# EAGLE design ServoFaderTB6612.V.1.0 (EAGLE 9.6.2)
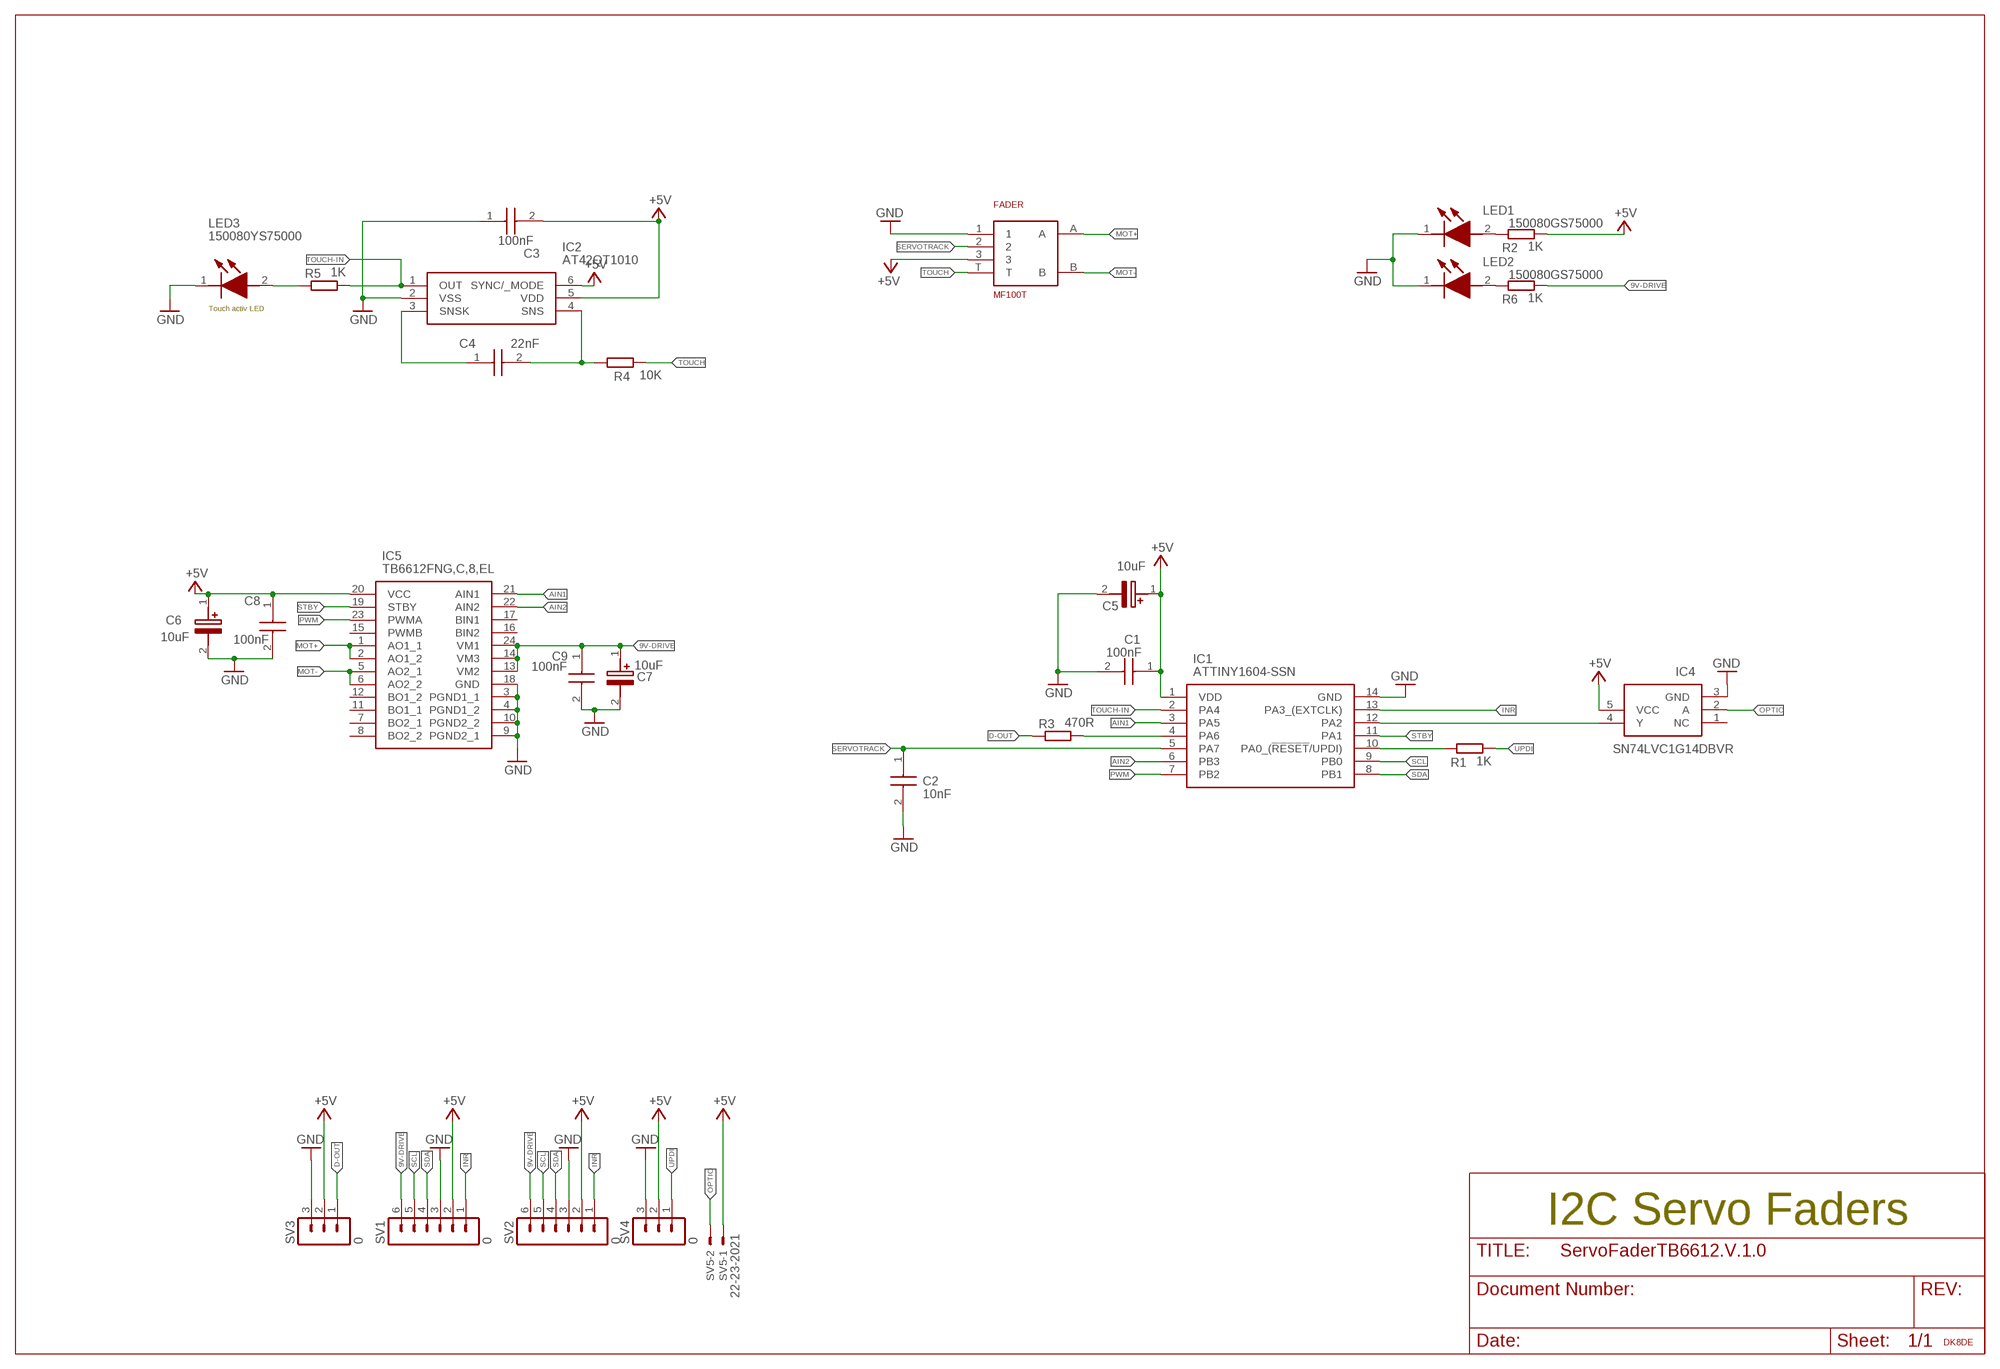
[diagram p0: schematic, sheet 1]

## Parts
C1  100nF  C0805C104K1RACTU  [C0805]
C2  10nF  C0805Y103K4RACTU  [C0805]
C3  100nF  C0805C223K5RAC7210  [C0805]
C4  22nF  C0805C223K5RAC7210  [C0805]
C5  10uF  T491A106M016AT7280  [T491A]
C6  10uF  T491A106M016AT7280  [T491A]
C7  10uF  T491A106M016AT7280  [T491A]
C8  100nF  C0805C104K1RACTU  [C0805]
C9  100nF  C0805C104K1RACTU  [C0805]
FADER  MF100T  SM10001NKA0X-HA1  [SM10001NKA0X-HA1]
IC1  ATTINY1604-SSN  [SOIC127P600X175-14N]
IC2  AT42QT1010  AT42QT1010-TSHR  [SOT95P280X145-6N]
IC4  SN74LVC1G14DBVR  [SOT95P280X145-5N]
IC5  TB6612FNG,C,8,EL  [SOP65P760X160-24N]
LED1  150080GS75000  [LEDM2012X80N]
LED2  150080GS75000  [LEDM2012X80N]
LED3  150080YS75000  [LEDC2012X80N]
LOGO  DK8DESS  [DK8DE_KLEIN]
R1  1K  R-EU_R0805  [R0805]
R2  1K  R-EU_R0805  [R0805]
R3  470R  R-EU_R0805  [R0805]
R4  10K  R-EU_R0805  [R0805]
R5  1K  R-EU_R0805  [R0805]
R6  1K  R-EU_R0805  [R0805]
SV1  0  MA06-1  [MA06-1]
SV2  0  MA06-1  [MA06-1]
SV3  0  MA03-1  [MA03-1]
SV4  0  MA03-1  [MA03-1]
SV5  22-23-2021  [22-23-2021]

## Nets
9V-DRIVE: C7.1(+) C9.1 IC5.13(VM2) IC5.14(VM3) IC5.24(VM1) R6.2 SV1.6 SV2.6
+5V: C1.1 C3.2 C5.1(+) C6.1(+) C8.1 FADER.3 IC1.1(VDD) IC2.5(VDD) IC2.6(SYNC/_MODE) IC4.5(VCC) IC5.20(VCC) R2.2 SV1.2 SV2.2 SV3.2 SV4.2 SV5.1
AIN1: IC1.3(PA5) IC5.21(AIN1)
AIN2: IC1.6(PB3) IC5.22(AIN2)
D-OUT: R3.1 SV3.1
GND: C1.2 C2.2 C3.1 C5.2(-) C6.2(-) C7.2(-) C8.2 C9.2 FADER.1 IC1.14(GND) IC2.2(VSS) IC4.3(GND) IC5.3(PGND1_1) IC5.4(PGND1_2) IC5.9(PGND2_1) IC5.10(PGND2_2) IC5.18(GND) LED1.1(K) LED2.1(K) LED3.1(K) SV1.3 SV2.3 SV3.3 SV4.3
INR: IC1.13(PA3_(EXTCLK)) SV1.1 SV2.1
MOT+: FADER.A IC5.1(AO1_1) IC5.2(AO1_2)
MOT-: FADER.B IC5.5(AO2_1) IC5.6(AO2_2)
N$1: IC1.10(PA0_(!RESET!/UPDI)) R1.1
N$2: LED1.2(A) R2.1
N$3: LED2.2(A) R6.1
N$4: IC1.12(PA2) IC4.4(Y)
N$5: IC1.4(PA6) R3.2
N$7: C4.1 IC2.3(SNSK)
N$8: C4.2 IC2.4(SNS) R4.1
N$9: LED3.2(A) R5.1
OPTIO: IC4.2(A) SV5.2
PWM: IC1.7(PB2) IC5.23(PWMA)
SCL: IC1.9(PB0) SV1.5 SV2.5
SDA: IC1.8(PB1) SV1.4 SV2.4
SERVOTRACK: C2.1 FADER.2 IC1.5(PA7)
STBY: IC1.11(PA1) IC5.19(STBY)
TOUCH: FADER.T R4.2
TOUCH-IN: IC1.2(PA4) IC2.1(OUT) R5.2
UPDI: R1.2 SV4.1
Unconnected: IC4.1(NC) IC5.7(BO2_1) IC5.8(BO2_2) IC5.11(BO1_1) IC5.12(BO1_2) IC5.15(PWMB) IC5.16(BIN2) IC5.17(BIN1)

## Notes on the sheet
- Touch activ LED
- I2C Servo Faders

## Library data of the parts
C1 C8 C9 = SamacSys_Parts:C0805C104K1RACTU: SMD Comm X7R, Ceramic, 0.1 uF, 10%, 100 VDC, 250 VDC, 125C, -55C, X7R, SMD, MLCC, Temperature Stable, Class II, 2.5 % , 10 GOhms, 16 mg, 0805, 2mm, 1.25mm, 1mm, 0.75mm, 0.5mm, 2500, 78 Weeks, 80 Source: Datasheet <https://content.kemet.com/datasheets/KEM_C1002_X7R_SMD.pdf>; DESCRIPTION: SMD Comm X7R, Ceramic, 0.1 uF, 10%, 100 VDC, 250 VDC, 125C, -55C, X7R, SMD, MLCC, Temperature Stable, Class II, 2.5 % , 10 GOhms, 16 mg, 0805, 2mm, 1.25mm, 1mm, 0.75mm, 0.5mm, 2500, 78 Weeks, 80; HEIGHT: 1.1mm; MANUFACTURER_NAME: KEMET; MANUFACTURER_PART_NUMBER: C0805C104K1RACTU; MOUSER_PART_NUMBER: 80-C0805C104K1R; MOUSER_PRICE-STOCK: https://www.mouser.co.uk/ProductDetail/KEMET/C0805C104K1RACTU?qs=%252BnQd%252BVdkwTpk7hSy9esUqA%3D%3D
C2 = SamacSys_Parts:C0805Y103K4RACTU: SMD Comm X7R FF, Ceramic, 0.01 uF, 10%, 16 VDC, 40 VDC, 125C, -55C, X7R, SMD, MLCC, FF-CAP, Floating Electrode, 3.5 % , 100 GOhms, 13 mg, 0805, 2mm, 1.25mm, 0.78mm, 0.75mm, 0.5mm, 4000, 78 Weeks, 80 Source: Datasheet <https://content.kemet.com/datasheets/KEM_C1015_X7R_FF-CAP_SMD.pdf>; DESCRIPTION: SMD Comm X7R FF, Ceramic, 0.01 uF, 10%, 16 VDC, 40 VDC, 125C, -55C, X7R, SMD, MLCC, FF-CAP, Floating Electrode, 3.5 % , 100 GOhms, 13 mg, 0805, 2mm, 1.25mm, 0.78mm, 0.75mm, 0.5mm, 4000, 78 Weeks, 80; HEIGHT: 1.1mm; MANUFACTURER_NAME: KEMET; MANUFACTURER_PART_NUMBER: C0805Y103K4RACTU; MOUSER_PART_NUMBER: 80-C0805Y103K4R; MOUSER_PRICE-STOCK: https://www.mouser.co.uk/ProductDetail/KEMET/C0805Y103K4RACTU?qs=sbamQQFaV8yazvNwKcnfeQ%3D%3D
C3 C4 = SamacSys_Parts:C0805C223K5RAC7210: SMD Comm X7R, Ceramic, 0.022 uF, 10%, 50 VDC, 125 VDC, 125C, -55C, X7R, SMD, MLCC, Temperature Stable, Class II, 2.5 % , 45.4545 GOhms, 11 mg, 0805, 2mm, 1.25mm, 0.78mm, 0.75mm, 0.5mm, 15000, 78 Weeks, 80 Source: Datasheet <https://content.kemet.com/datasheets/KEM_C1002_X7R_SMD.pdf>; DESCRIPTION: SMD Comm X7R, Ceramic, 0.022 uF, 10%, 50 VDC, 125 VDC, 125C, -55C, X7R, SMD, MLCC, Temperature Stable, Class II, 2.5 % , 45.4545 GOhms, 11 mg, 0805, 2mm, 1.25mm, 0.78mm, 0.75mm, 0.5mm, 15000, 78 Weeks, 80; HEIGHT: 1.1mm; MANUFACTURER_NAME: KEMET; MANUFACTURER_PART_NUMBER: C0805C223K5RAC7210
C5-C7 = SamacSys_Parts:T491A106M016AT7280: T491, Tantalum, MnO2 Tantalum, Commercial Grade, 10 uF, 20%, 16 VDC, 125C, -55C, 85C, SMD, MnO2, Molded, 6 % , 3 Ohms, 1600 nA, 58.6 mg, 3216, 1.6mm, Height Max = 1.8mm, 9000, 156 Weeks Source: Datasheet <https://content.kemet.com/datasheets/KEM_T2005_T491.pdf>; DESCRIPTION: T491, Tantalum, MnO2 Tantalum, Commercial Grade, 10 uF, 20%, 16 VDC, 125C, -55C, 85C, SMD, MnO2, Molded, 6 % , 3 Ohms, 1600 nA, 58.6 mg, 3216, 1.6mm, Height Max = 1.8mm, 9000, 156 Weeks; HEIGHT: 1.8mm; MANUFACTURER_NAME: KEMET; MANUFACTURER_PART_NUMBER: T491A106M016AT7280; MOUSER_PART_NUMBER: 80-T491A106M16AT7280; MOUSER_PRICE-STOCK: https://www.mouser.co.uk/ProductDetail/KEMET/T491A106M016AT7280?qs=WOKUqv%2F%2FT%2FbXhYcv8zpvIg%3D%3D
FADER = Slider:SM10001NKA0X-HA1: Behringer X-Touch Motor-Fader MF100T
IC1 = SamacSys_Parts:ATTINY1604-SSN: 8-bit Microcontrollers - MCU 20MHz, 16KB, SOIC14, Ind 105C, Green, Tube Source: Datasheet <https://datasheet.datasheetarchive.com/originals/distributors/Datasheets_SAMA/eaab196c485c39f061614dd847a70670.pdf>; DESCRIPTION: 8-bit Microcontrollers - MCU 20MHz, 16KB, SOIC14, Ind 105C, Green, Tube; HEIGHT: 1.75mm; MANUFACTURER_NAME: Microchip; MANUFACTURER_PART_NUMBER: ATTINY1604-SSN; MOUSER_PART_NUMBER: 556-ATTINY1604-SSN; MOUSER_PRICE-STOCK: https://www.mouser.co.uk/ProductDetail/Microchip-Technology-Atmel/ATTINY1604-SSN?qs=T3oQrply3y8tu5s3g%2F7NqA%3D%3D
IC2 = SamacSys_Parts:AT42QT1010-TSHR: AT42QT1010-TSHR, Spread-Spectrum Charge-Transfer Touch Screen Controller, 14 bit, 6-Pin SOT-23 Source: Datasheet <http://www.atmel.com/images/atmel-9541-at42-qtouch-bsw-at42qt1010_datasheet.pdf>; DESCRIPTION: AT42QT1010-TSHR, Spread-Spectrum Charge-Transfer Touch Screen Controller, 14 bit, 6-Pin SOT-23; HEIGHT: 1.45mm; MANUFACTURER_NAME: Microchip; MANUFACTURER_PART_NUMBER: AT42QT1010-TSHR; MOUSER_PART_NUMBER: 556-AT42QT1010-TSHR; MOUSER_PRICE-STOCK: https://www.mouser.co.uk/ProductDetail/Microchip-Technology/AT42QT1010-TSHR?qs=xbJoyvfFV%2F%252BFK88JVR2efg%3D%3D
IC4 = SamacSys_Parts:SN74LVC1G14DBVR: TEXAS INSTRUMENTS - SN74LVC1G14DBVR - IC, SCHMITT TRIGGER INVERTER, SMD Source: Datasheet <https://datasheet.datasheetarchive.com/originals/distributors/Datasheets-DGA13/1136296.pdf>; DESCRIPTION: TEXAS INSTRUMENTS - SN74LVC1G14DBVR - IC, SCHMITT TRIGGER INVERTER, SMD; HEIGHT: 1.45mm; MANUFACTURER_NAME: Texas Instruments; MANUFACTURER_PART_NUMBER: SN74LVC1G14DBVR; MOUSER_PART_NUMBER: 595-SN74LVC1G14DBVR; MOUSER_PRICE-STOCK: https://www.mouser.co.uk/ProductDetail/Texas-Instruments/SN74LVC1G14DBVR?qs=dT9u2OTAaVWRIgCrQFnxuQ%3D%3D
IC5 = SamacSys_Parts:TB6612FNG,C,8,EL: otor / Motion / Ignition Controllers & Drivers Brush Motor Driver IC Source: Datasheet <http://toshiba.semicon-storage.com/info/docget.jsp?did=10660&prodName=TB6612FNG>; DESCRIPTION: otor / Motion / Ignition Controllers & Drivers Brush Motor Driver IC; HEIGHT: 1.6mm; MANUFACTURER_NAME: Toshiba; MANUFACTURER_PART_NUMBER: TB6612FNG,C,8,EL; MOUSER_PART_NUMBER: 757-TB6612FNGC8EL; MOUSER_PRICE-STOCK: https://www.mouser.co.uk/ProductDetail/Toshiba/TB6612FNGC8EL?qs=rsevcuukUAy2UalRuv4E%2FQ%3D%3D
LED1 LED2 = SamacSys_Parts:150080GS75000: 150080GS75000, Wurth Elektronik WL-SMCW 520 nm Green LED, 2012 (0805) Clear SMD package Source: Datasheet <https://katalog.we-online.com/led/datasheet/150080GS75000.pdf>; DESCRIPTION: 150080GS75000, Wurth Elektronik WL-SMCW 520 nm Green LED, 2012 (0805) Clear SMD package; HEIGHT: 0.8mm; MANUFACTURER_NAME: Wurth Elektronik; MANUFACTURER_PART_NUMBER: 150080GS75000; MOUSER_PART_NUMBER: 710-150080GS75000; MOUSER_PRICE-STOCK: https://www.mouser.co.uk/ProductDetail/Wurth-Elektronik/150080GS75000?qs=2kOmHSv6VfQRoTEZVk1mGA%3D%3D
LED3 = SamacSys_Parts:150080YS75000: LED,Wurth Elektronik,150080YS75000 Source: Datasheet <https://katalog.we-online.de/led/datasheet/150080YS75000.pdf>; DESCRIPTION: LED,Wurth Elektronik,150080YS75000; HEIGHT: 0.8mm; MANUFACTURER_NAME: Wurth Elektronik; MANUFACTURER_PART_NUMBER: 150080YS75000; MOUSER_PART_NUMBER: 710-150080YS75000; MOUSER_PRICE-STOCK: https://www.mouser.co.uk/ProductDetail/Wurth-Elektronik/150080YS75000?qs=LlUlMxKIyB3k0fZGrDMI2w%3D%3D
LOGO = LOGOS:DK8DE
R1-R6 = rcl:R-EU_: RESISTOR, European symbol; SPICEPREFIX: R
SV1 SV2 = con-lstb_IBM:MA06-1: PIN HEADER; OC_FARNELL: unknown; OC_NEWARK: unknown
SV3 SV4 = con-lstb:MA03-1: PIN HEADER; OC_FARNELL: unknown; OC_NEWARK: unknown
SV5 = con-molex:22-23-2021: .100" (2.54mm) Center Header - 2 Pin; MF: MOLEX; MPN: 22-23-2021; OC_FARNELL: 1462926; OC_NEWARK: 25C3832

## Board
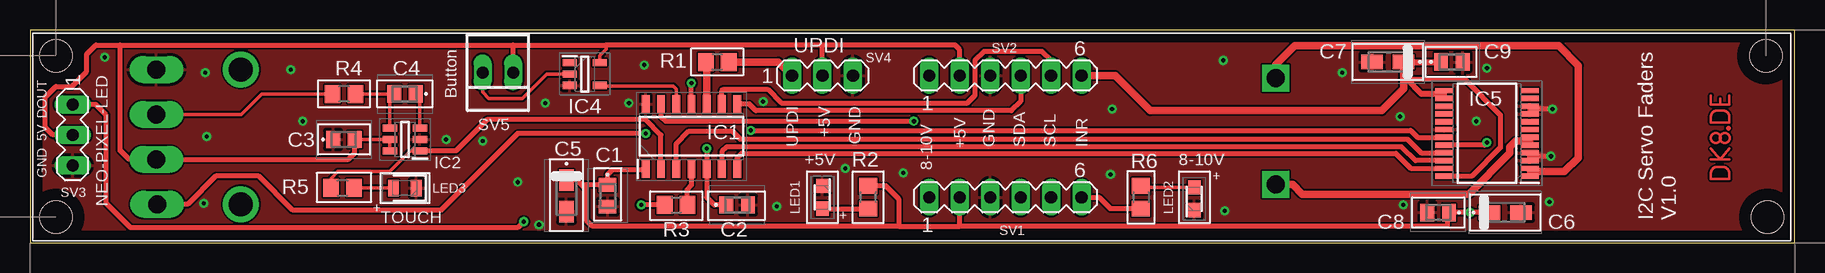
[diagram p1: board, top side]
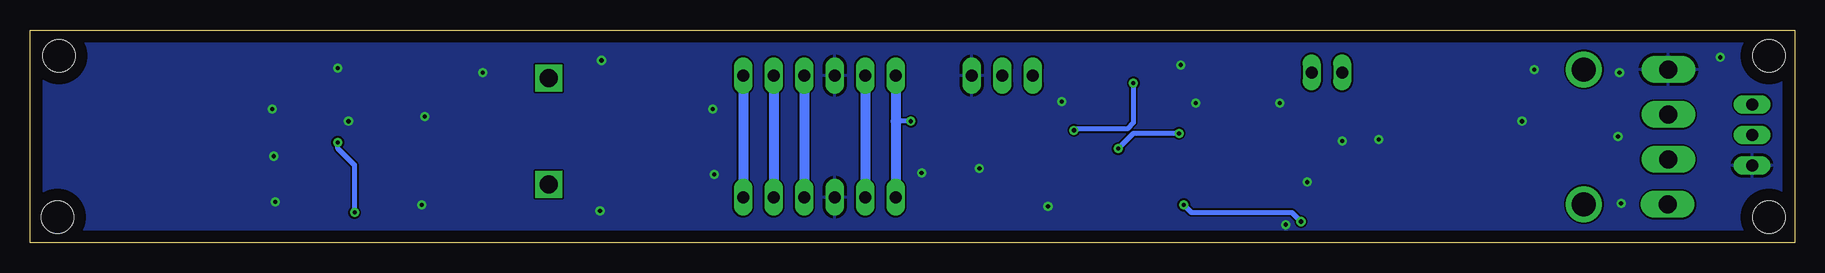
[diagram p2: board, bottom side, seen from below]

Size 147.07 x 17.78 mm. Coordinates in mm from the lower left corner, seen from the top.
Outline: 0,0 147.07,0 147.07,17.78 0,17.78 0,0
Copper layers (1*16): Top 0.035mm / dielectric 0.15mm / Bottom 0.035mm
Design rules "Aisler": minimum track width 6mil, minimum drill 0.35mm, track to track 6mil, track to pad 6mil, pad to pad 6mil, via to via 6mil, smd to smd 6mil, copper to edge 40mil, drill to drill 6mil, minimum pad ring 10mil, minimum via ring 8mil, stop-mask expansion 4mil, vias tented up to drill 0mil, thermal gap 10mil
Holes 2.69 mm at 144.65,15.62 144.78,2.16 2.16,15.62 2.16,2.16

### Footprints (pad centres in the part's own frame; a part is rotated, then mirrored left to right if it is on the bottom)
C0805 = smd 1.15 x 1.45: 1 -0.9,0; 2 0.9,0
T491A = smd 1.8 x 1.23: 1 -1.31,0; 2 1.31,0
SM10001NKA0X-HA1 = drill 1.5 long: 1 0,0; 2 0.05,-11.25; 3 0,-7.5; T 0,-3.75 | drill 1.5 square: A 93.291,-0.703; B 93.291,-9.61 | drill 2: P$7 7.032,-11.251; P$8 7.032,0
SOIC127P600X175-14N = smd 1.5 x 0.65: 1 -2.7,3.81; 2 -2.7,2.54; 3 -2.7,1.27; 4 -2.7,0; 5 -2.7,-1.27; 6 -2.7,-2.54; 7 -2.7,-3.81; 8 2.7,-3.81; 9 2.7,-2.54; 10 2.7,-1.27; 11 2.7,0; 12 2.7,1.27; 13 2.7,2.54; 14 2.7,3.81
SOT95P280X145-6N = smd 1.2 x 0.6: 1 -1.25,0.95; 2 -1.25,0; 3 -1.25,-0.95; 4 1.25,-0.95; 5 1.25,0; 6 1.25,0.95
SOT95P280X145-5N = smd 1.2 x 0.6: 1 -1.25,0.95; 2 -1.25,0; 3 -1.25,-0.95; 4 1.25,-0.95; 5 1.25,0.95
SOP65P760X160-24N = smd 1.525 x 0.45: 1 -3.562,3.575; 2 -3.562,2.925; 3 -3.562,2.275; 4 -3.562,1.625; 5 -3.562,0.975; 6 -3.562,0.325; 7 -3.562,-0.325; 8 -3.562,-0.975; 9 -3.562,-1.625; 10 -3.562,-2.275; 11 -3.562,-2.925; 12 -3.562,-3.575; 13 3.562,-3.575; 14 3.562,-2.925; 15 3.562,-2.275; 16 3.562,-1.625; 17 3.562,-0.975; 18 3.562,-0.325; 19 3.562,0.325; 20 3.562,0.975; 21 3.562,1.625; 22 3.562,2.275; 23 3.562,2.925; 24 3.562,3.575
LEDM2012X80N = smd 1.2 x 1.05: 1 -0.95,0; 2 0.95,0
LEDC2012X80N = smd 0.9 x 1.4: 1 -0.95,0; 2 0.95,0
R0805 = smd 1.3 x 1.5: 1 -0.95,0; 2 0.95,0
MA06-1 = drill 1.016 long: 1 -6.35,0; 2 -3.81,0; 3 -1.27,0; 4 1.27,0; 5 3.81,0; 6 6.35,0
MA03-1 = drill 1.016 long: 1 -2.54,0; 2 0,0; 3 2.54,0
22-23-2021 = drill 1 long: 1 -1.27,0; 2 1.27,0

### Placement (x,y rotation side)
C1  48.13,3.94 270 top
C2  58.93,3.17 0 top
C3  26.16,8.64 0 top
C4  31.24,12.45 180 top
C5  44.7,3.94 270 top
C6  122.94,2.54 0 top
C7  113.16,15.11 180 top
C8  117.35,2.54 180 top
C9  118.49,15.11 0 top
FADER  10.54,14.48 0 top
IC1  55.12,8.89 90 top
IC2  31.24,8.64 180 top
IC4  46.23,14.1 0 top
IC5  121.41,9.14 180 top
LED1  66.04,3.81 270 top
LED2  97.03,3.68 90 top
LED3  31.24,4.57 180 top
LOGO  140.84,8.13 90 top
R1  57.28,15.11 0 top
R2  69.85,3.81 90 top
R3  53.85,3.17 0 top
R4  26.16,12.45 180 top
R5  26.04,4.57 180 top
R6  92.58,3.81 270 top
SV1  81.28,3.81 0 top
SV2  81.28,13.97 0 top
SV3  3.56,9.02 270 top
SV4  66.04,13.97 0 top
SV5  38.99,14.22 180 top

### Tracks (layer width: path | path; a pad name or v marks a point on that pad's centre or on a via)
9V-DRIVE
  Top 0.406: R6.2 90.04,2.86 89.09,3.81 SV1.6 | 114.72,13.68 119.55,13.68 122.53,10.69 122.53,7.95 120.14,5.57 IC5.24 | 117.6,12.45 117.85,12.7 IC5.13 IC5.14
  Top 0.508: C7.1 C9.1 | 117.6,12.45 115.95,12.45 114.72,13.68 114.47,13.93
  Top 0.61: SV2.6 90.42,13.97 93.34,11.05 112.65,11.05 114.47,12.86 114.47,13.93 C7.1
  Bottom 0.813: SV2.6 SV1.6
+5V  (via drill 0.35)
  Top 0.305: C3.2 IC2.5 IC2.6 | IC4.5 47.48,15.64 48.01,16.17 48.01,16.51
  Top 0.406: IC1.1 51.24,6.11 48.51,6.11 48.13,5.73 C1.1 48.1,4.87 45.93,4.87 | 72.39,1.4 72.39,3.68 71.31,4.76 R2.2 | 7.49,16.51 7.49,7.75 8.26,6.98 FADER.3 26.54,6.98 27.05,7.49 C3.2 | 7.49,16.51 40.26,16.51 | 40.26,16.51 48.01,16.51 66.04,16.51 | SV3.2 1.91,9.02 1.27,9.65 1.27,12.17 2.16,13.06 3.48,13.06 4.72,14.3 4.72,15.75 5.49,16.51 7.49,16.51 | SV5.1 40.26,16.51 | 72.39,1.4 77.47,1.4 | 77.47,1.4 SV1.2 | 72.39,1.4 46.86,1.4 46.35,1.91 46.35,4.45 45.93,4.87 | 45.93,4.87 45.55,5.25 C5.1 | 77.47,1.4 118.12,1.4 118.12,2.41 C8.1 v120.02,2.54 C6.1 | v121.41,8.38 121.2,8.17 IC5.20 | SV2.2 77.47,16.13 77.09,16.51 66.04,16.51 | SV4.2 66.04,16.51
  Bottom 0.406: v120.02,2.54 120.02,6.48 121.41,7.87 v121.41,8.38
  Bottom 0.813: SV2.2 SV1.2
AIN1
  Top 0.406: IC5.21 115.92,7.52 114.78,8.66 59.18,8.66 58.52,9.32 54.91,9.32 53.85,8.26 IC1.3
AIN2
  Top 0.406: IC5.22 115.46,6.87 114.3,8.03 58.77,8.03 58.07,8.03 57.66,7.62 IC1.6
D-OUT  (via drill 0.35)
  Top 0.406: v41.15,1.78 40.64,1.27 8.38,1.27 6.35,3.3 6.35,10.67 5.46,11.56 SV3.1 | R3.1 v50.93,3.17
  Bottom 0.406: v50.93,3.17 50.29,2.54 41.91,2.54 v41.15,1.78
GND  (via drill 0.35)
  Top 0.406: IC5.9 IC5.10 125.22,11.18 v126.87,11.18 | IC5.3 IC5.4 125.25,7.24 v126.75,7.24
  other vias: 49.91,11.68 42.42,1.52 37.72,8.51 22.73,10.16 99.57,2.67 61.09,11.81 67.94,6.22 72.77,5.84 90.04,5.71 90.17,11.18 120.52,10.16 34.67,8.64 21.72,14.48 42.93,11.68 6.22,15.49 114.17,10.54 114.43,3.17 126.62,3.43 109.35,14.22 121.41,14.61 14.48,3.3 14.73,8.89 14.61,14.22 51.18,14.86 99.44,15.24 40.64,5.08 62.23,3.05
  pour Bottom: 0,17.78 147.07,17.78 147.07,0 0,0
  pour Top: 0,17.78 147.07,17.78 147.07,0 0,0
INR  (via drill 0.35)
  Top 0.406: IC1.13 52.58,10.54 52.96,10.16 v73.66,10.16
  Bottom 0.406: v73.66,10.16 74.93,10.16
  Bottom 0.813: SV2.1 74.93,10.16 SV1.1
MOT+
  Top 0.406: IC5.2 IC5.1 125.36,5.95 125.73,5.95
  Top 0.61: 125.73,5.95 127.87,5.95 129.03,7.11 129.03,14.81 127.38,16.46 105.41,16.46 103.83,14.88 FADER.A
MOT-
  Top 0.406: IC5.6 124.97,8.51 IC5.5
  Top 0.61: FADER.B 105.23,4.87 106.03,4.06 119.89,4.06 123.32,7.49 123.32,8.02 123.8,8.51 124.97,8.51
N$1
  Top 0.61: R1.1 56.39,15.05 IC1.10
N$2
  Top 0.406: LED1.2 R2.1
N$3
  Top 0.305: LED2.2 92.71,4.63 R6.1
N$4
  Top 0.305: IC1.12 53.85,12.83 53.59,13.08 47.54,13.08 IC4.4
N$5
  Top 0.406: IC1.4 55.12,4.83 54.74,4.45 54.74,3.24 R3.2
N$7
  Top 0.305: C4.1 32.49,12.1 IC2.3
N$8
  Top 0.305: R4.1 C4.2 29.99,12.1 IC2.4
N$9
  Top 0.305: LED3.2 R5.1
OPTIO
  Top 0.305: SV5.2 37.72,12.57 38.23,12.06 41.02,12.06 43.05,14.1 IC4.2
PWM
  Top 0.406: IC5.23 115.07,6.22 113.81,7.47 59.31,7.47 58.93,7.09 IC1.7
SCL
  Top 0.406: IC1.9 57.66,12.7 57.78,12.83 61.47,12.83 62.61,11.68 78.11,11.68 78.74,12.32 78.74,15.24 79.5,16 84.33,16 85.09,15.24 SV2.5
  Bottom 0.813: SV2.5 SV1.5
SDA
  Top 0.406: SV2.4 82.55,11.81 81.79,11.05 60.5,11.05 59.94,11.6 IC1.8
  Bottom 0.813: SV2.4 SV1.4
SERVOTRACK  (via drill 0.35)
  Top 0.406: C2.1 57.02,3.17 56.39,3.81 IC1.5 v56.39,7.87 | v51.31,9.14 40.64,9.14 34.23,2.73 21.91,2.73 19.05,5.59 15.49,5.59 13.13,3.23 FADER.2
  Bottom 0.406: v51.31,9.14 55.12,9.14 v56.39,7.87
STBY  (via drill 0.35)
  Top 0.406: IC1.11 v55.12,13.34 | v60.07,9.4 115.06,9.4 115.64,8.82 IC5.19
  Bottom 0.406: v55.12,13.34 55.12,10.03 55.63,9.53 59.94,9.53 v60.07,9.4
TOUCH
  Top 0.305: FADER.T 17.59,10.73 19.3,12.45 R4.2
TOUCH-IN
  Top 0.305: R5.2 25.09,5.4 25.65,5.97 29.97,5.97 31.69,7.69 IC2.1
  Top 0.406: IC1.2 52.58,9.02 51.31,10.29 38.1,10.29 35.5,7.69 IC2.1
UPDI
  Top 0.61: R1.2 62.36,15.11 SV4.1

### Text on the board
tPlace: UPDI | Button | UPDI | +5V | GND | DOUT | 5V | +5V | GND | SDA | SCL | INR | 8-10V | +5V | 8-10V | GND | + | NEO-PIXEL-LED | + | TOUCH | + | I2C Servo Faders / V1.0